# Altium schematic sheet water_system_module.SchDoc
size A4
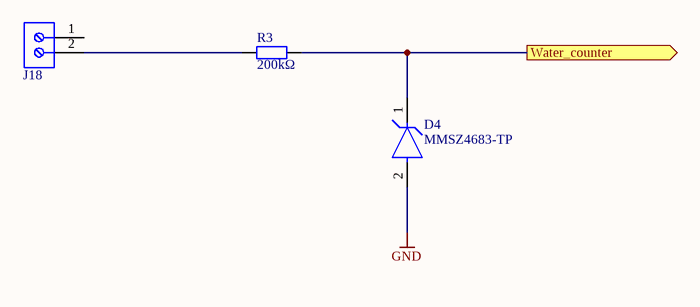
[diagram p0: water_system_module.SchDoc]

## Parts
D4  MMSZ4683-TP  [FP-SOD-123-MFG]
J18  282836-2  [TECO-282836-2_V]  (value not drawn)
R3  200kΩ  [RESC2013X50X30ML20T20]

## Ports
Water_counter (out)

## Nets
GND: D4.2(A)
Water_counter: D4.1(C) R3.2 ; port Water_counter
NetJ18_2: J18.2 R3.1

Not connected (* = marked no-connect by the designer): J18 1

## Library data of the parts
D4 = CMP-56208-000004-1: DIODE ZENER 3V 500MW SOD123; Element Configuration: Single; Voltage Tolerance: 5%; Peak Reverse Current: 800nA; Forward Voltage: 950mV; Package Quantity: 1; Packaging: Tape and Reel; Number of Pins: 2; Min Operating Temperature: -55°C; Radiation Hardening: No; Max Power Dissipation: 500mW; Power Dissipation: 500mW; Working Voltage: 3V; Max Operating Temperature: 150°C; Lead Free: Lead Free; Max Reverse Leakage Current: 800nA; Mount: Surface Mount; Zener Voltage: 3V; Tolerance: 5%
J18 = CMP-1684-00017-1: Female Header, Pitch 5 mm, 1 x 2 Position, Height 10 mm, Tail Length 3.5 mm, Rohs, Bulk; Manufacturer: TE Connectivity; Wire Gauge: 16-30AWG; Product Training Modules: Wire-to-BoardEurostyleTerminalBlocks; Clamp Material - Plating: Brass-NickelPlated; Voltage: 300V; Mating Orientation: HorizontalwithBoard; Current: 13.5A; Pitch: 0.197"(5.00mm); Screw Thread: M3; 3D Model: 282836-2.pdf; Other Names: 5ULV-02B / A98076; Dynamic Catalog: BuchananSeries; Number of Levels: 1; Torque - Screw: 0.68Nm(6Lb-In); Featured Product: EurostyleTerminalBlockConnectors; Positions Per Level: 2; Wire Termination: Screw-RisingCageClamp; Datasheet URL: http://www.te.com.cn/commerce/DocumentDelivery/DDEController?Action=showdoc&DocId=Catalog+Section%7F1308389_EUROSTYLE_TERMINAL_BLOCKS%7F0607%7Fpdf%7FEnglish%7FENG_CS_1308389_EUROSTYLE_TERMINAL_BLOCKS_0607.pdf%7F282836-2; Color: Green; Family: TerminalBlocks-WiretoBoard; RoHS Information: 282836-2StatementofCompliance; Standard Package: 300; Contact Material - Plating: Brass-TinPlated; Manufacturer URL: http://www.te.com; Housing Material: Polyamide(PA66),Nylon6/6; Features: Interlocking(Side); Package Description: Female Header, Pitch 5 mm, 1 x 2 Position, Height 10 mm, Tail Length 3.5 mm; Mounting Type: ThroughHole; Package Reference: THD; Packaging: Bulk; Series: Buchanan; Category: Connectors,Interconnects; Screw Material - Plating: Brass-NickelPlated
R3 = Res_0805: Resistor